# Altium schematic sheet V_15.SchDoc
size A4
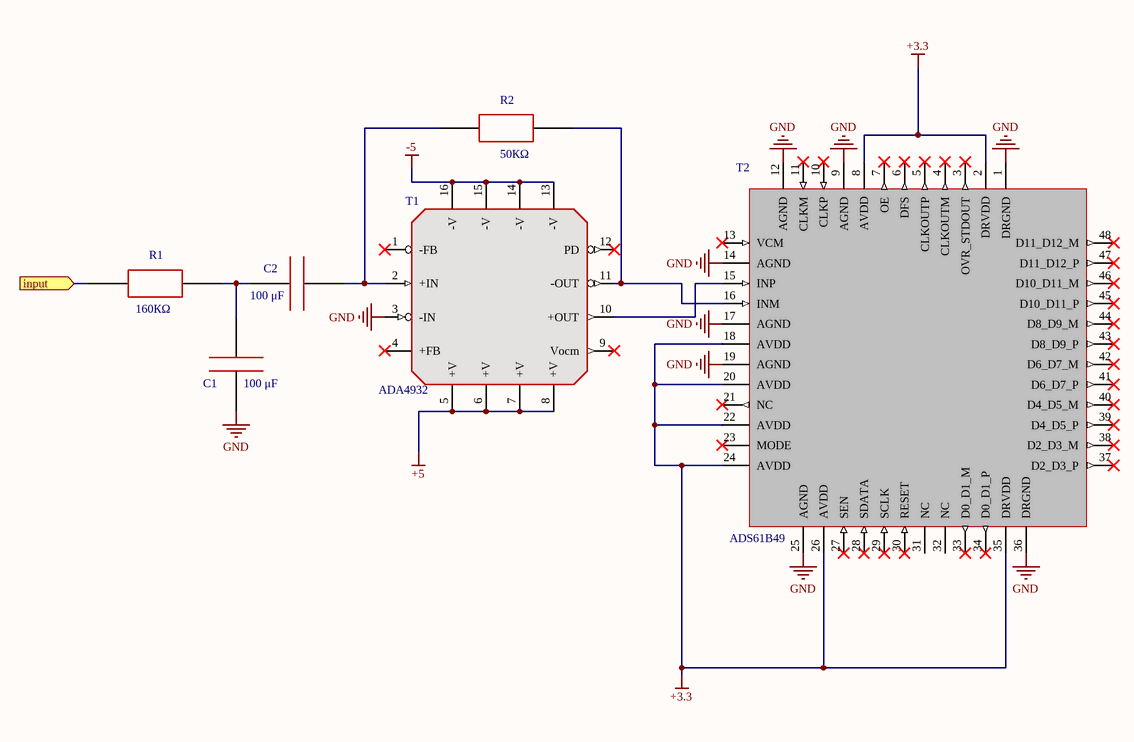
[diagram p0: V_15.SchDoc]

## Parts
C1  100 μF  [C]
C2  100 μF  [C]
R1  160КΩ  [R]
R2  50КΩ  [R]
T1  ADA4932  [ADA4932]
T2  ADS61B49  [ADS61B49]

## Ports
input (in)

## Nets
+3.3: T2.2(DRVDD) T2.8(AVDD) T2.18(AVDD) T2.20(AVDD) T2.22(AVDD) T2.24(AVDD) T2.26(AVDD) T2.35(DRVDD)
+5: T1.5(+V) T1.6(+V) T1.7(+V) T1.8(+V)
-5: T1.13(-V) T1.14(-V) T1.15(-V) T1.16(-V)
GND: C1.3 T1.3(-IN) T2.1(DRGND) T2.9(AGND) T2.12(AGND) T2.14(AGND) T2.17(AGND) T2.19(AGND) T2.25(AGND) T2.36(DRGND)
input: R1.0 ; port input
NetC1_2: C1.2 C2.3 R1.1
NetC2_2: C2.2 R2.0 T1.2(+IN)
NetR2_1: R2.1 T1.11(-OUT) T2.16(INM)
NetT1_10: T1.10(+OUT) T2.15(INP)

Not connected (* = marked no-connect by the designer): T1 1(-FB)* 4(+FB)* 9(Vocm)* 12(PD)*; T2 3(OVR_STDOUT)* 4(CLKOUTM)* 5(CLKOUTP)* 6(DFS)* 7(OE)* 10(CLKP)* 11(CLKM)* 13(VCM)* 21(NC)* 23(MODE)* 27(SEN)* 28(SDATA)* 29(SCLK)* 30(RESET)* 31(NC) 32(NC) 33(D0_D1_M)* 34(D0_D1_P)* 37(D2_D3_P)* 38(D2_D3_M)* 39(D4_D5_P)* 40(D4_D5_M)* 41(D6_D7_P)* 42(D6_D7_M)* 43(D8_D9_P)* 44(D8_D9_M)* 45(D10_D11_P)* 46(D10_D11_M)* 47(D11_D12_P)* 48(D11_D12_M)*

## Library data of the parts
C1 C2 = Capacitor
R1 R2 = Resistor